# Altium schematic sheet SDRAM.SchDoc
size A4; PageSetup: Record=PageOptions|CenterHorizontal=False|CenterVertical=False|PrintScale=0.95|XCorrection=0.00|YCorrection=0.00|PrintKind=1|BorderSize=5000000|LeftOffset=0|BottomOffset=0|Orientation=1|PaperLength=1000|PaperWidth=1000|Scale=100|PaperSource=15|PrintQuality=600|MediaType=1|DitherType=10|PaperKind=A4|PrintScaleMode=1; Organization: My Company; Address1: Address Line 1; Address2: Address Line 2; Address3: Address Line 3; Address4: Address Line 4; SheetNumber: 3; SheetTotal: 7
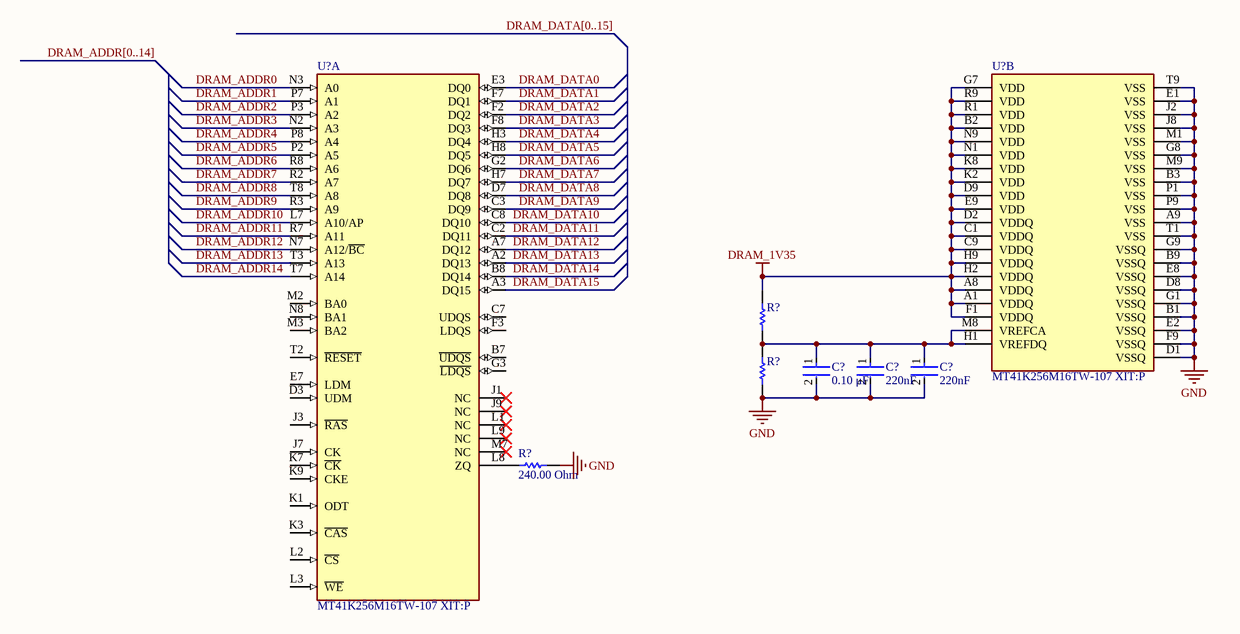
[diagram p0: SDRAM.SchDoc]

## Parts
(Parts that share a designator on the sheet are numbered #1, #2 ... from top to bottom, then left to right.)
C?#1  value 0.10 μF  [FP-C0402-BB-MFG]  (hidden comment: C0402C104K8RACAUTO)
C?#2  Capacitance: 220nF  [FP-CL802-IPC_C]  (hidden comment: CL05B224KP5NNND)
C?#3  Capacitance: 220nF  [FP-CL802-IPC_C]  (hidden comment: CL05B224KP5NNND)
R?#1  RC0402FR-071K5L  [RESC1005X40X25ML05T10]  (value not drawn)
R?#2  RC0402FR-071K5L  [RESC1005X40X25ML05T10]  (value not drawn)
R?#3  value 240.00 Ohm  [RESC0402(1005)_L]  (hidden comment: 240R 1% 0402(1005))
U?#1  MT41K256M16TW-107 XIT:P  [FP-TW-MFG]  (part A of 2)
U?#2  MT41K256M16TW-107 XIT:P  [FP-TW-MFG]  (part B of 2)

## Nets
DRAM_1V35: R?#1.2 U?#2.A1(VDDQ) U?#2.A8(VDDQ) U?#2.B2(VDD) U?#2.C1(VDDQ) U?#2.C9(VDDQ) U?#2.D2(VDDQ) U?#2.D9(VDD) U?#2.E9(VDD) U?#2.F1(VDDQ) U?#2.G7(VDD) U?#2.H2(VDDQ) U?#2.H9(VDDQ) U?#2.K2(VDD) U?#2.K8(VDD) U?#2.N1(VDD) U?#2.N9(VDD) U?#2.R1(VDD) U?#2.R9(VDD)
GND: C?#1.2 C?#2.2 C?#3.2 R?#2.1 R?#3.2 U?#2.A9(VSS) U?#2.B1(VSSQ) U?#2.B3(VSS) U?#2.B9(VSSQ) U?#2.D1(VSSQ) U?#2.D8(VSSQ) U?#2.E1(VSS) U?#2.E2(VSSQ) U?#2.E8(VSSQ) U?#2.F9(VSSQ) U?#2.G1(VSSQ) U?#2.G8(VSS) U?#2.G9(VSSQ) U?#2.J2(VSS) U?#2.J8(VSS) U?#2.M1(VSS) U?#2.M9(VSS) U?#2.P1(VSS) U?#2.P9(VSS) U?#2.T1(VSS) U?#2.T9(VSS)
DRAM_ADDR0: U?#1.N3(A0)
DRAM_ADDR1: U?#1.P7(A1)
DRAM_ADDR2: U?#1.P3(A2)
DRAM_ADDR3: U?#1.N2(A3)
DRAM_ADDR4: U?#1.P8(A4)
DRAM_ADDR5: U?#1.P2(A5)
DRAM_ADDR6: U?#1.R8(A6)
DRAM_ADDR7: U?#1.R2(A7)
DRAM_ADDR8: U?#1.T8(A8)
DRAM_ADDR9: U?#1.R3(A9)
DRAM_ADDR10: U?#1.L7(A10/AP)
DRAM_ADDR11: U?#1.R7(A11)
DRAM_ADDR12: U?#1.N7(A12/~{BC})
DRAM_ADDR13: U?#1.T3(A13)
DRAM_ADDR14: U?#1.T7(A14)
DRAM_DATA0: U?#1.E3(DQ0)
DRAM_DATA1: U?#1.F7(DQ1)
DRAM_DATA2: U?#1.F2(DQ2)
DRAM_DATA3: U?#1.F8(DQ3)
DRAM_DATA4: U?#1.H3(DQ4)
DRAM_DATA5: U?#1.H8(DQ5)
DRAM_DATA6: U?#1.G2(DQ6)
DRAM_DATA7: U?#1.H7(DQ7)
DRAM_DATA8: U?#1.D7(DQ8)
DRAM_DATA9: U?#1.C3(DQ9)
DRAM_DATA10: U?#1.C8(DQ10)
DRAM_DATA11: U?#1.C2(DQ11)
DRAM_DATA12: U?#1.A7(DQ12)
DRAM_DATA13: U?#1.A2(DQ13)
DRAM_DATA14: U?#1.B8(DQ14)
DRAM_DATA15: U?#1.A3(DQ15)
NetC?#1_1: C?#1.1 C?#2.1 C?#3.1 R?#1.1 R?#2.2 U?#2.H1(VREFDQ) U?#2.M8(VREFCA)
NetR?#3_1: R?#3.1 U?#1.L8(ZQ)

Not connected (* = marked no-connect by the designer): U?#1 B7(~{UDQS}) C7(UDQS) D3(UDM) E7(LDM) F3(LDQS) G3(~{LDQS}) J1(NC)* J3(~{RAS}) J7(CK) J9(NC)* K1(ODT) K3(~{CAS}) K7(~{CK}) K9(CKE) L1(NC)* L2(~{CS}) L3(~{WE}) L9(NC)* M2(BA0) M3(BA2) M7(NC)* N8(BA1) T2(~{RESET})

## Buses and harness runs
bus DRAM_ADDR[0..14]
bus DRAM_DATA[0..15]

## Notes on the sheet
- Title:
- Author:
- Approved:
- Size:
- Date:
- Git Hash:
- A4
- Prj:
- SW Version:
- Variant:
- Edited:
- CONFIDENTIAL
- File:

## Library data of the parts
C?#1 = CMP-03020-002733-1: CAP CER 0.1UF 10V X7R 0402; Manufacturer: Kemet; Material: Ceramic; Tolerance: 0.1; Description: C0402 0.10 μF X7R 10.00% 10 V; Temperature Coefficient: 15%; ComponentLink2Description: Datasheet; Automotive: No; Digikey Description: CAP CER 0.1UF 10V X7R 0402; Temperature Range Low: -55°C; Ipc Land Pattern Name: CAPC10050X50; Lead Free: Yes; Category: Cap; Package: C0402-BB; Octopart: https://octopart.com/c0402c104k8racauto-kemet-9145167; Voltage Rating: 10 V; Device Class L2: Capacitors; Capacitance: 0.10 μF; Temperature Range High: +125°C; Height: 0.55mm; ComponentLink2URL: https://content.kemet.com/datasheets/KEM_C1002_X7R_SMD.pdf; Temperature: -55°C to +125°C; Manufacturer Part Number: C0402C104K8RACAUTO; Device Class L1: Passive Components; Temperature Characteristic: X7R; RoHS: TRUE; Device Class L3: Ceramic Capacitors
C?#2 C?#3 = CMP-13271-003770-1: Cap Ceramic 220nF 10V X7R ±10% SMD 0402 +125°C Paper T/R; Radiation Hardening: No; Length: 1mm; Voltage Rating (DC): 10V; Tolerance: 10%; Dielectric: X7R; Depth: 0.5mm; Min Operating Temperature: -55°C; Mount: Surface Mount; Width: 0.02inch; Packaging: Tape and Reel; Case/Package: 0402; Max Operating Temperature: 125°C; Height: 0.5mm; Thickness: 0.022inch; Voltage Rating: 10V; Package Quantity: 50000
R?#1 R?#2 = CMP-2002-07464-1: Manufacturer: Yageo / Phycomp; Part Number: RC0402FR-071K5L
R?#3 = CMP-1011-00438-1: 240R 0.063W 1% 0402 (1005 Metric)  SMD; Case-Metric: 1005; Case-EIA: 0402; Power: 0.063 W; Tolerance: 1 %; Technology: SMT
U?#1 U?#2 = CMP-2000-07474-2: IC DRAM 4GBIT PARALLEL 96FBGA; Data Bus Width: 16b; Address Bus Width: 15b; Operating Supply Voltage: 1.35V; Max Frequency: 933MHz; Density: 4Gb; Memory Type: RAM; Access Time: 1.07ns; RoHS Compliant: Yes; Mount: Surface Mount; Contact Plating: Copper; Interface: Parallel; Case/Package: TFBGA; Frequency: 933MHz; Min Operating Temperature: -40°C; Packaging: Tray; Max Operating Temperature: 95°C; Number of Pins: 96